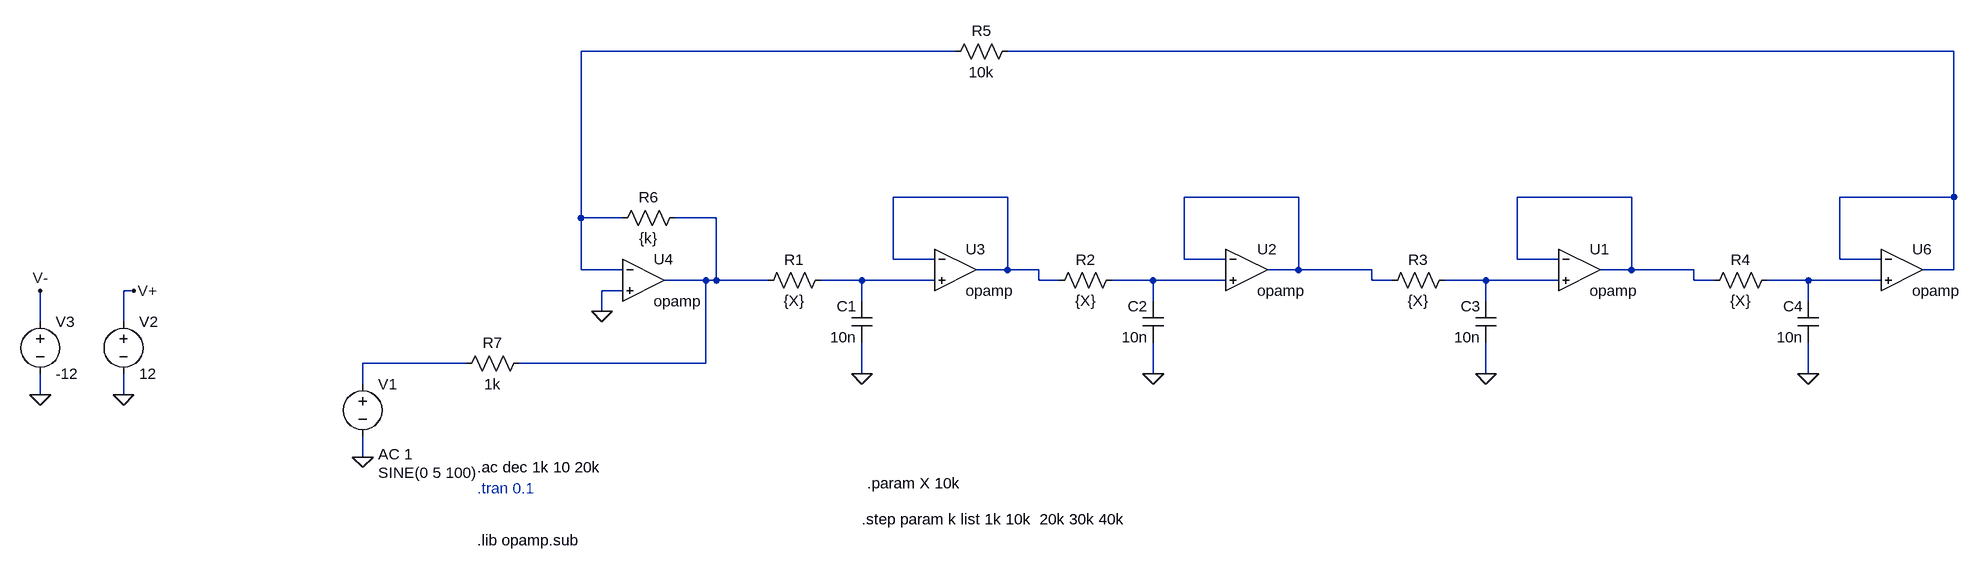
[diagram p0: schematic bandpass.asc]
bandpass.asc, the LTspice schematic file:
Version 4.1
SHEET 1 5156 680
WIRE 736 -288 160 -288
WIRE 2272 -288 816 -288
WIRE 816 -64 640 -64
WIRE 1264 -64 1088 -64
WIRE 1776 -64 1600 -64
WIRE 2272 -64 2272 -288
WIRE 2272 -64 2096 -64
WIRE 160 -32 160 -288
WIRE 224 -32 160 -32
WIRE 368 -32 304 -32
WIRE 640 32 640 -64
WIRE 704 32 640 32
WIRE 1088 32 1088 -64
WIRE 1152 32 1088 32
WIRE 1600 32 1600 -64
WIRE 1664 32 1600 32
WIRE 2096 32 2096 -64
WIRE 2160 32 2096 32
WIRE 160 48 160 -32
WIRE 224 48 160 48
WIRE 816 48 816 -64
WIRE 816 48 768 48
WIRE 864 48 816 48
WIRE 1264 48 1264 -64
WIRE 1264 48 1216 48
WIRE 1376 48 1264 48
WIRE 1776 48 1776 -64
WIRE 1776 48 1728 48
WIRE 1872 48 1776 48
WIRE 2272 48 2272 -64
WIRE 2272 48 2224 48
WIRE 352 64 288 64
WIRE 368 64 368 -32
WIRE 368 64 352 64
WIRE 448 64 368 64
WIRE 592 64 528 64
WIRE 704 64 592 64
WIRE 864 64 864 48
WIRE 896 64 864 64
WIRE 1040 64 976 64
WIRE 1152 64 1040 64
WIRE 1376 64 1376 48
WIRE 1408 64 1376 64
WIRE 1552 64 1488 64
WIRE 1664 64 1552 64
WIRE 1872 64 1872 48
WIRE 1904 64 1872 64
WIRE 2048 64 1984 64
WIRE 2160 64 2048 64
WIRE -528 80 -544 80
WIRE 224 80 192 80
WIRE 592 96 592 64
WIRE 1040 96 1040 64
WIRE 1552 96 1552 64
WIRE 2048 96 2048 64
WIRE 192 112 192 80
WIRE -672 128 -672 80
WIRE -544 128 -544 80
WIRE -16 192 -176 192
WIRE 352 192 352 64
WIRE 352 192 64 192
WIRE 592 208 592 160
WIRE 1040 208 1040 160
WIRE 1552 208 1552 160
WIRE 2048 208 2048 160
WIRE -176 224 -176 192
WIRE -672 240 -672 208
WIRE -544 240 -544 208
WIRE -176 336 -176 304
FLAG -176 336 0
FLAG -672 240 0
FLAG -544 240 0
FLAG -672 80 V-
FLAG -528 80 V+
FLAG 592 208 0
FLAG 1040 208 0
FLAG 1552 208 0
FLAG 2048 208 0
FLAG 192 112 0
SYMBOL voltage -176 208 R0
WINDOW 3 24 152 Left 2
WINDOW 123 24 124 Left 2
WINDOW 39 0 0 Left 0
SYMATTR InstName V1
SYMATTR Value SINE(0 5 100)
SYMATTR Value2 AC 1
SYMBOL voltage -544 112 R0
WINDOW 123 0 0 Left 0
WINDOW 39 0 0 Left 0
SYMATTR InstName V2
SYMATTR Value 12
SYMBOL voltage -672 112 R0
WINDOW 123 0 0 Left 0
WINDOW 39 0 0 Left 0
SYMATTR InstName V3
SYMATTR Value -12
SYMBOL res 544 48 R90
WINDOW 0 0 56 VBottom 2
WINDOW 3 32 56 VTop 2
SYMATTR InstName R1
SYMATTR Value {X}
SYMBOL cap 608 160 R180
WINDOW 0 24 56 Left 2
WINDOW 3 24 8 Left 2
SYMATTR InstName C1
SYMATTR Value 10n
SYMBOL res 992 48 R90
WINDOW 0 0 56 VBottom 2
WINDOW 3 32 56 VTop 2
SYMATTR InstName R2
SYMATTR Value {X}
SYMBOL cap 1056 160 R180
WINDOW 0 24 56 Left 2
WINDOW 3 24 8 Left 2
SYMATTR InstName C2
SYMATTR Value 10n
SYMBOL res 1504 48 R90
WINDOW 0 0 56 VBottom 2
WINDOW 3 32 56 VTop 2
SYMATTR InstName R3
SYMATTR Value {X}
SYMBOL cap 1568 160 R180
WINDOW 0 24 56 Left 2
WINDOW 3 24 8 Left 2
SYMATTR InstName C3
SYMATTR Value 10n
SYMBOL res 2000 48 R90
WINDOW 0 0 56 VBottom 2
WINDOW 3 32 56 VTop 2
SYMATTR InstName R4
SYMATTR Value {X}
SYMBOL cap 2064 160 R180
WINDOW 0 24 56 Left 2
WINDOW 3 24 8 Left 2
SYMATTR InstName C4
SYMATTR Value 10n
SYMBOL res 320 -48 R90
WINDOW 0 0 56 VBottom 2
WINDOW 3 32 56 VTop 2
SYMATTR InstName R6
SYMATTR Value {k}
SYMBOL OpAmps\\opamp 2192 -16 R0
SYMATTR InstName U6
SYMBOL OpAmps\\opamp 1696 -16 R0
SYMATTR InstName U1
SYMBOL OpAmps\\opamp 1184 -16 R0
SYMATTR InstName U2
SYMBOL OpAmps\\opamp 736 -16 R0
SYMATTR InstName U3
SYMBOL OpAmps\\opamp 256 0 R0
SYMATTR InstName U4
SYMBOL res 832 -304 R90
WINDOW 0 0 56 VBottom 2
WINDOW 3 32 56 VTop 2
SYMATTR InstName R5
SYMATTR Value 10k
SYMBOL res 80 176 R90
WINDOW 0 0 56 VBottom 2
WINDOW 3 32 56 VTop 2
SYMATTR InstName R7
SYMATTR Value 1k
TEXT 0 352 Left 2 !.ac dec 1k 10 20k
TEXT 0 464 Left 2 !.lib opamp.sub
TEXT 600 376 Left 2 !.param X 10k
TEXT 592 432 Left 2 !.step param k list 1k 10k  20k 30k 40k
TEXT 0 384 Left 2 ;.tran 0.1

The netlist it stands for:
* bandpass.asc
V1 N011 0 SINE(0 5 100) AC 1
V2 V+ 0 12
V3 V- 0 -12
R1 N007 N006 {X}
C1 0 N007 10n
R2 N008 N003 {X}
C2 0 N008 10n
R3 N009 N004 {X}
C3 0 N009 10n
R4 N010 N005 {X}
C4 0 N010 10n
R6 N006 N001 {k}
X§U6 N002 N010 N002 opamp Aol=100K GBW=10Meg  ; pins invin noninvin out
X§U1 N005 N009 N005 opamp Aol=100K GBW=10Meg  ; pins invin noninvin out
X§U2 N004 N008 N004 opamp Aol=100K GBW=10Meg  ; pins invin noninvin out
X§U3 N003 N007 N003 opamp Aol=100K GBW=10Meg  ; pins invin noninvin out
X§U4 N001 0 N006 opamp Aol=100K GBW=10Meg  ; pins invin noninvin out
R5 N002 N001 10k
R7 N006 N011 1k
.ac dec 1k 10 20k
.lib opamp.sub
.param X 10k
.step param k list 1k 10k  20k 30k 40k
* .tran 0.1
.backanno
.end